# Altium schematic sheet drone.SchDoc
size A4
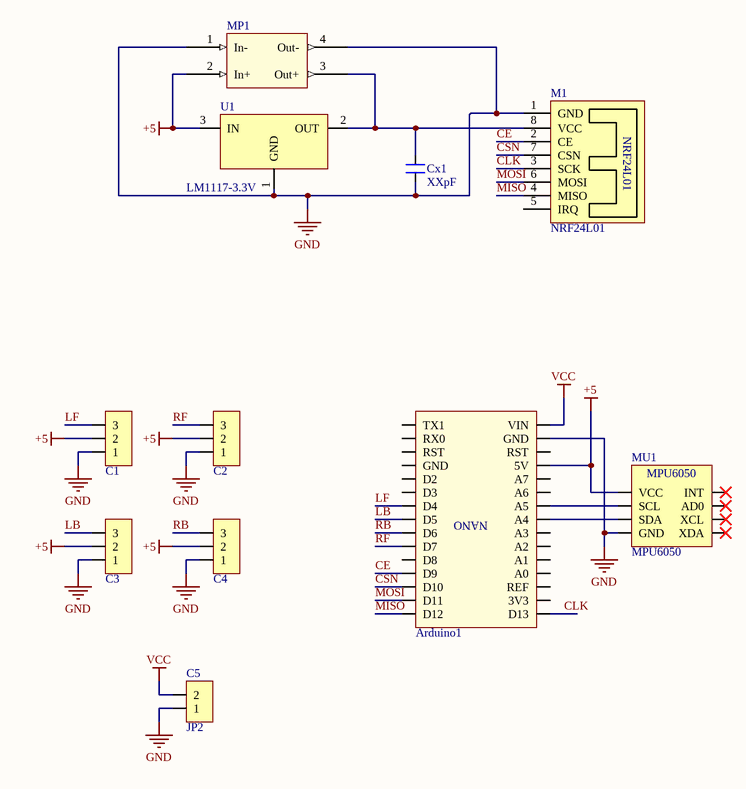
[diagram p0: drone.SchDoc]

## Parts
Arduino1  Arduino Nano  [Arduino Nano]  (value not drawn)
C1  JP3  [JP3-C1T]  (value not drawn)
C2  JP3  [JP3-C1T]  (value not drawn)
C3  JP3  [JP3-C1T]  (value not drawn)
C4  JP3  [JP3-C1T]  (value not drawn)
C5  JP2  [JP2-C1T]
Cx1  XXpF  [CN-SMD-1206]
M1  NRF24L01  [NRF24L01]
MP1  MP2307 DC-DC Switching Buck Step-Down Module  [Mini360]  (value not drawn)
MU1  MPU6050  [MPU6050]
U1  LM1117-3.3V  [SOT223]

## Nets
+5: Arduino1.5V C1.2 C2.2 C3.2 C4.2 MP1.2(In+) MU1.1(VCC) U1.3(IN)
GND: Arduino1.GND C1.1 C2.1 C3.1 C4.1 C5.1 Cx1.1 M1.1(GND) MP1.1(In-) MP1.4(Out-) MU1.2(GND) U1.1(GND)
VCC: Arduino1.VIN C5.2
CE: Arduino1.D9 M1.2(CE)
CLK: Arduino1.D13 M1.3(SCK)
CSN: Arduino1.D10 M1.7(CSN)
LB: Arduino1.D5 C3.3
LF: Arduino1.D4 C1.3
MISO: Arduino1.D12 M1.4(MISO)
MOSI: Arduino1.D11 M1.6(MOSI)
RB: Arduino1.D6 C4.3
RF: Arduino1.D7 C2.3
NetArduino1_A4: Arduino1.A4 MU1.4(SDA)
NetArduino1_A5: Arduino1.A5 MU1.3(SCL)
NetCx1_2: Cx1.2 M1.8(VCC) MP1.3(Out+) U1.2(OUT)

Not connected (* = marked no-connect by the designer): Arduino1 3V3 A0 A1 A2 A3 A6 A7 D2 D3 D8 REF RST RX0 TX1; M1 5(IRQ); MU1 5(XDA)* 6(XCL)* 7(AD0)* 8(INT)*

## Notes on the sheet
- (in symbol Arduino Nano) NANO

## Library data of the parts
Arduino1 = Arduino Nano: Value: Cau 1A
C1-C4 = JP3: WR-PHD 2.54 mm Angled Socket Header; Manufacturer: W¨¹rth Elektronik eiSos GmbH; partNo: 613003143121; ComponentLink1 Description: Manufacturer; ComponentLink2 Description: Datasheet; NoPins: 03; Created Date: 29 March 2013; ComponentLink1URL: http://www.we-online.com; ComponentLink2URL: http://katalog.we-online.de/em/datasheet/6130xx143121.pdf; Created by: Karrer Zheng
C5 = JP2: WR-PHD 2.54 mm Angled Socket Header; Manufacturer: W¨¹rth Elektronik eiSos GmbH; partNo: 613002143121; ComponentLink1 Description: Manufacturer; ComponentLink2 Description: Datasheet; NoPins: 02; Created Date: 29 March 2013; ComponentLink1URL: http://www.we-online.com; ComponentLink2URL: http://katalog.we-online.de/em/datasheet/6130xx143121.pdf; Created by: Karrer Zheng
Cx1 = CN: Value: 33pF
MP1 = MP2307 Module
MU1 = MPU6050: Manufacturer: W¨¹rth Elektronik eiSos GmbH; partNo: 613004143121; ComponentLink1 Description: Manufacturer; ComponentLink2 Description: Datasheet; NoPins: 04; Created Date: 29 March 2013; ComponentLink1URL: http://www.we-online.com; ComponentLink2URL: http://katalog.we-online.de/em/datasheet/6130xx143121.pdf; Created by: Karrer Zheng
U1 = LM1117: 800mA Low-Dropout Linear Regulator; Creator: Nguyen Ba Bien; Website: http://group3i.net